# EAGLE schematic HM_Nightfall-mini-2e_v1 (EAGLE 9.6.2)
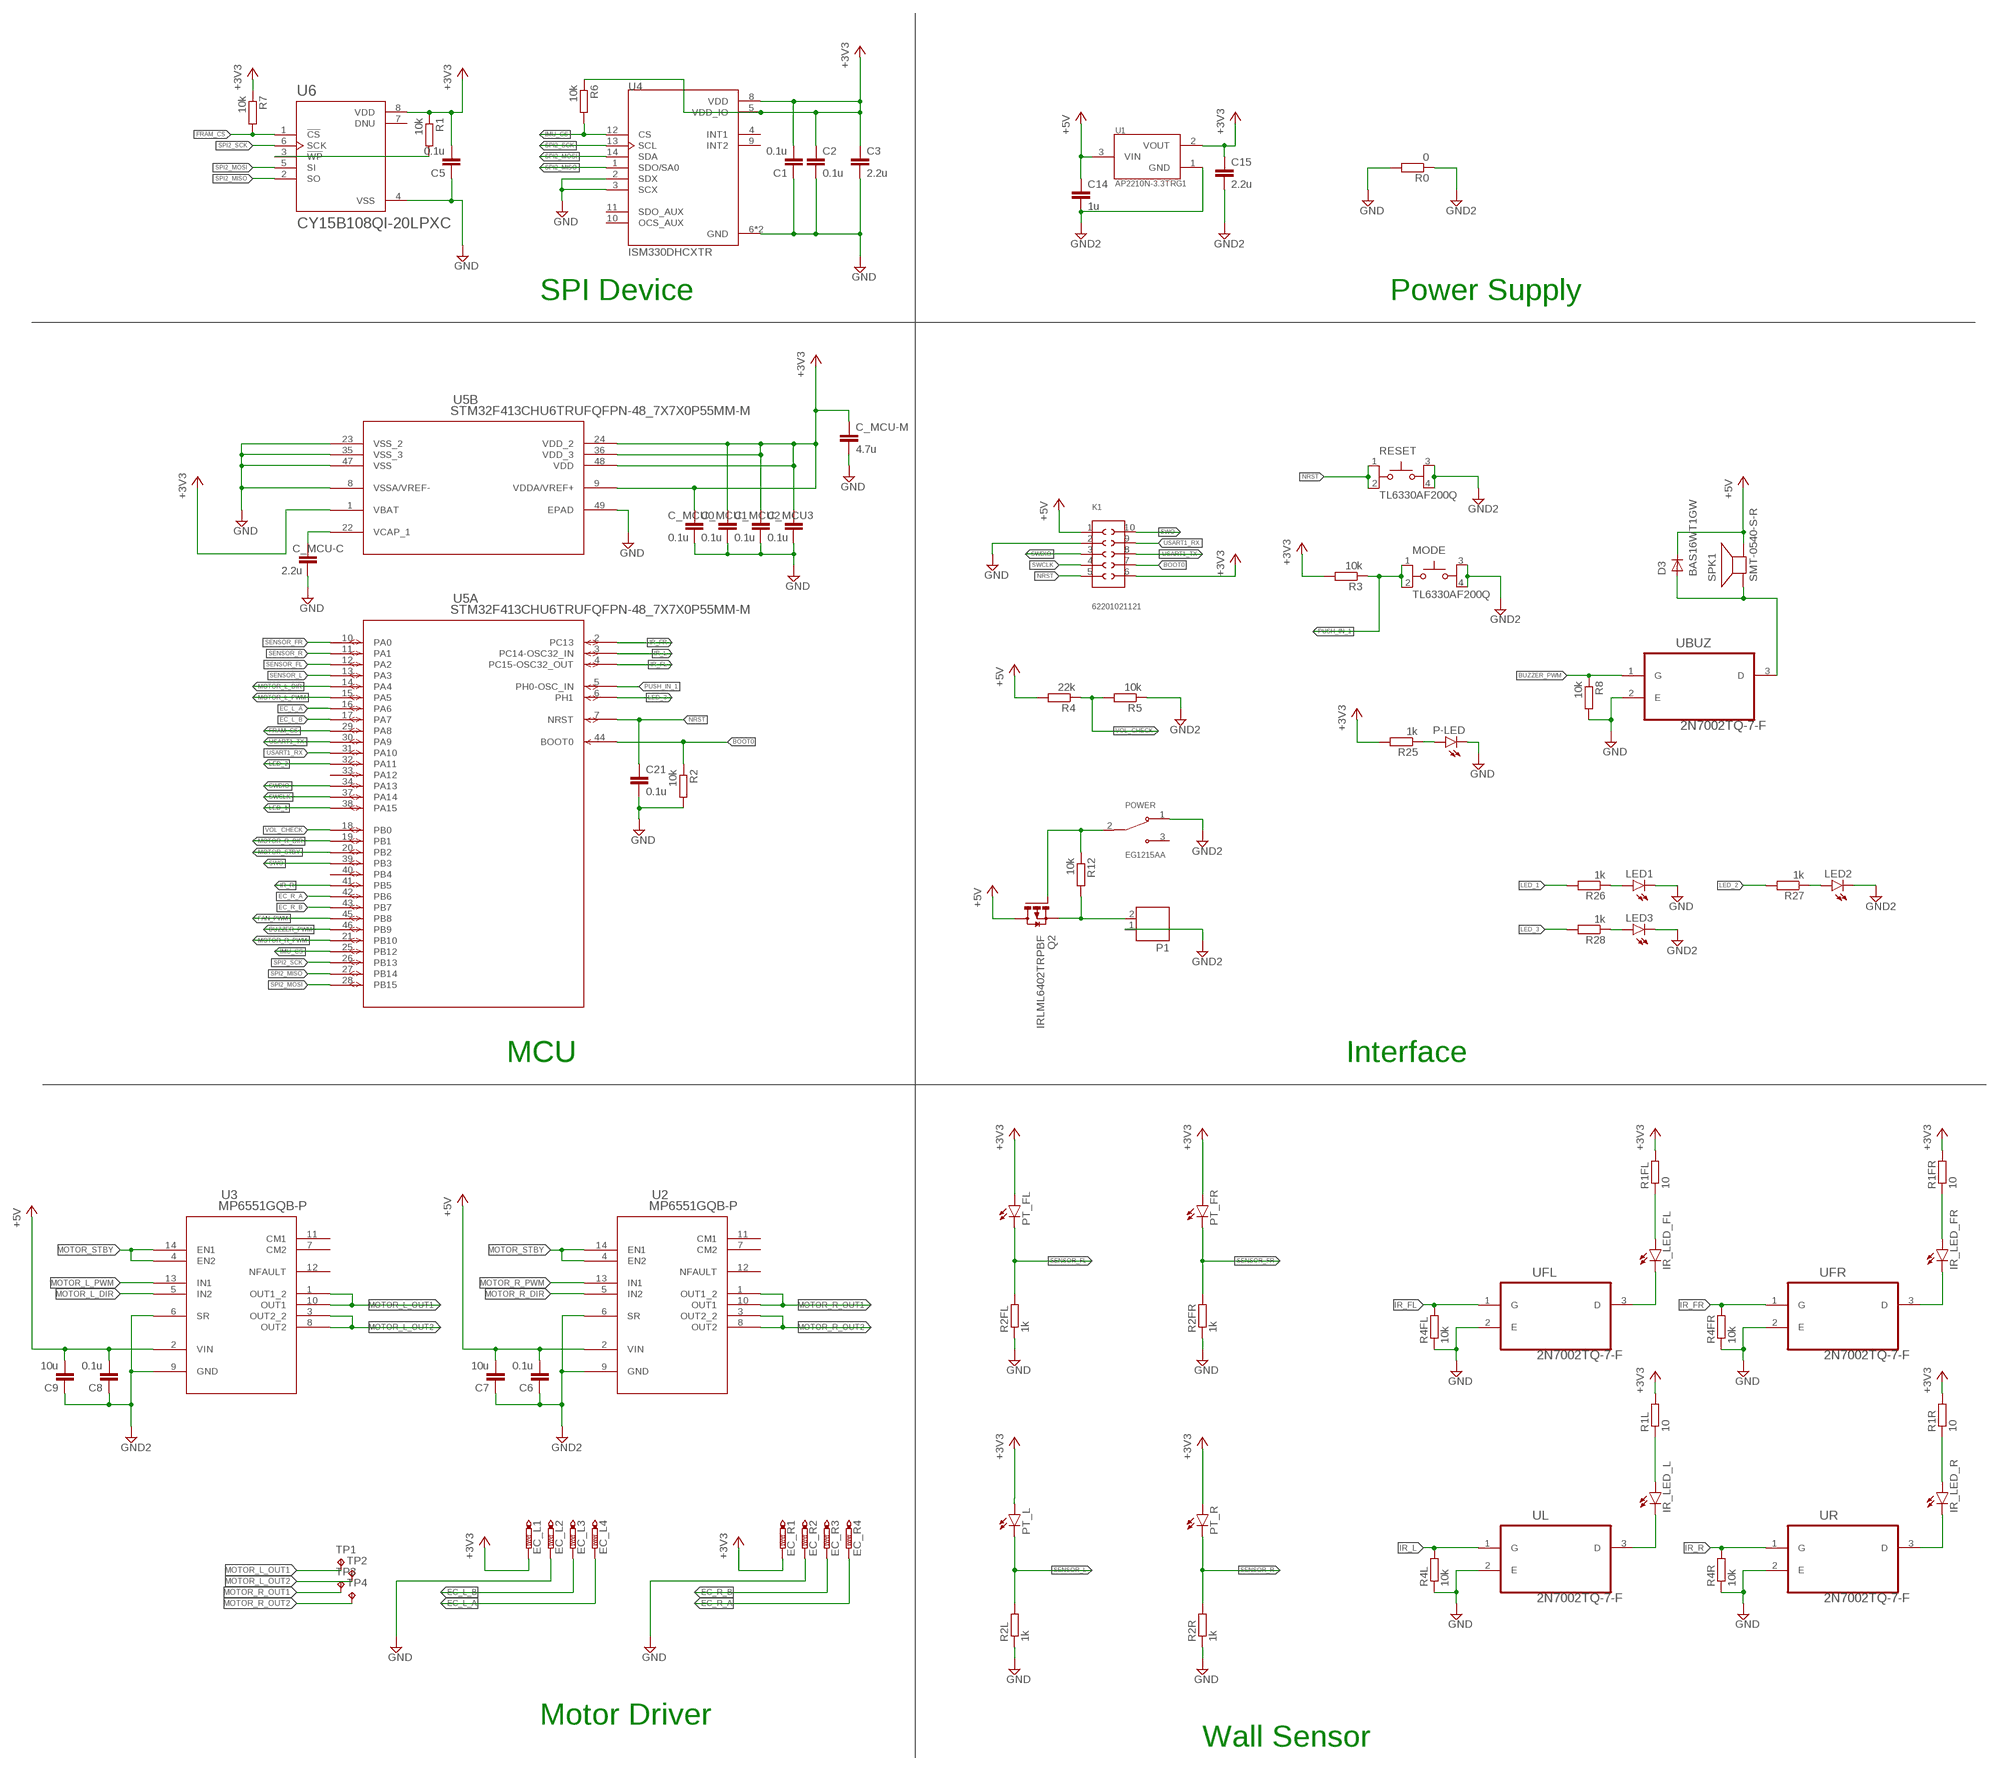
[diagram p0: schematic, sheet 1]

## Parts
C1  0.1u  C-EUC0402  [C0402]
C2  0.1u  C-EUC0402  [C0402]
C3  2.2u  C-EUC0402  [C0402]
C5  0.1u  C-EUC0402  [C0402]
C6  0.1u  C-EUC0402  [C0402]
C7  10u  C-EUC0402  [C0402]
C8  0.1u  C-EUC0402  [C0402]
C9  10u  C-EUC0402  [C0402]
C14  1u  C-EUC0402  [C0402]
C15  2.2u  C-EUC0402  [C0402]
C21  0.1u  C-EUC0402  [C0402]
C_MCU0  0.1u  C-EUC0402  [C0402]
C_MCU1  0.1u  C-EUC0402  [C0402]
C_MCU2  0.1u  C-EUC0402  [C0402]
C_MCU3  0.1u  C-EUC0402  [C0402]
C_MCU-C  2.2u  C-EUC0402  [C0402]
C_MCU-M  4.7u  C-EUC0402  [C0402]
D3  BAS16WT1GW  [SOT323]
EC_L1  PTR1TP06SQ  [TP06SQ]
EC_L2  PTR1TP06SQ  [TP06SQ]
EC_L3  PTR1TP06SQ  [TP06SQ]
EC_L4  PTR1TP06SQ  [TP06SQ]
EC_R1  PTR1TP06SQ  [TP06SQ]
EC_R2  PTR1TP06SQ  [TP06SQ]
EC_R3  PTR1TP06SQ  [TP06SQ]
EC_R4  PTR1TP06SQ  [TP06SQ]
IR_LED_FL  LED3MM  [LED3MM]
IR_LED_FR  LED3MM  [LED3MM]
IR_LED_L  LED3MM  [LED3MM]
IR_LED_R  LED3MM  [LED3MM]
K1  62201021121  [62201021121]
LED1  LEDCHIPLED_0603  [CHIPLED_0603]
LED2  LEDCHIPLED_0603  [CHIPLED_0603]
LED3  LEDCHIPLED_0603  [CHIPLED_0603]
MODE  TL6330AF200Q  [SW_TL6330AF200Q]
P1  JST-PH2  [JST-PH2]
P-LED  LEDCHIPLED_0603  [CHIPLED_0603]
POWER  EG1215AA  [SW_EG1215AA]
PT_FL  LED3MM  [LED3MM]
PT_FR  LED3MM  [LED3MM]
PT_L  LED3MM  [LED3MM]
PT_R  LED3MM  [LED3MM]
Q2  IRLML6402TRPBF  [SOT23]
R0  0  R-EU_R0402  [R0402]
R1  10k  R-EU_R0402  [R0402]
R1FL  10  R-EU_R0402  [R0402]
R1FR  10  R-EU_R0402  [R0402]
R1L  10  R-EU_R0402  [R0402]
R1R  10  R-EU_R0402  [R0402]
R2  10k  R-EU_R0402  [R0402]
R2FL  1k  R-EU_R0402  [R0402]
R2FR  1k  R-EU_R0402  [R0402]
R2L  1k  R-EU_R0402  [R0402]
R2R  1k  R-EU_R0402  [R0402]
R3  10k  R-EU_R0402  [R0402]
R4  22k  R-EU_R0402  [R0402]
R4FL  10k  R-EU_R0402  [R0402]
R4FR  10k  R-EU_R0402  [R0402]
R4L  10k  R-EU_R0402  [R0402]
R4R  10k  R-EU_R0402  [R0402]
R5  10k  R-EU_R0402  [R0402]
R6  10k  R-EU_R0402  [R0402]
R7  10k  R-EU_R0402  [R0402]
R8  10k  R-EU_R0402  [R0402]
R12  10k  R-EU_R0402  [R0402]
R25  1k  R-EU_R0402  [R0402]
R26  1k  R-EU_R0402  [R0402]
R27  1k  R-EU_R0402  [R0402]
R28  1k  R-EU_R0402  [R0402]
RESET  TL6330AF200Q  [SW_TL6330AF200Q]
SPK1  SMT-0540-S-R  [SMT-0540-S-R]
TP1  TPB1,27  [B1,27]
TP2  TPB1,27  [B1,27]
TP3  TPB1,27  [B1,27]
TP4  TPB1,27  [B1,27]
U1  AP2210N-3.3TRG1  [SOT95P280X145-3N]
U2  MP6551GQB-P  [QFN-14_MP6551_MNP]
U3  MP6551GQB-P  [QFN-14_MP6551_MNP]
U4  ISM330DHCXTR  [PQFN50P250X300X86-14N]
U5  STM32F413CHU6TRUFQFPN-48_7X7X0P55MM-M  [UFQFPN-48_7X7X0P55MM-M]
U6  CY15B108QI-20LPXC  [SON65P328X323X55-8N]
UBUZ  2N7002TQ-7-F  [SOT50P160X90-3N]
UFL  2N7002TQ-7-F  [SOT50P160X90-3N]
UFR  2N7002TQ-7-F  [SOT50P160X90-3N]
UL  2N7002TQ-7-F  [SOT50P160X90-3N]
UR  2N7002TQ-7-F  [SOT50P160X90-3N]

## Nets
+3V3 [power]: C1.2 C2.1 C3.1 C5.2 C15.1 C_MCU0.1 C_MCU1.1 C_MCU2.1 C_MCU3.1 C_MCU-M.1 EC_L1.TP EC_R1.TP K1.6 PT_FL.A PT_FR.A PT_L.A PT_R.A R1.1 R1FL.2 R1FR.2 R1L.2 R1R.2 R3.2 R6.1 R7.1 R25.2 U1.2(VOUT) U4.5(VDD_IO) U4.8(VDD) U5.1(B:VBAT) U5.9(B:VDDA/VREF+) U5.24(B:VDD_2) U5.36(B:VDD_3) U5.48(B:VDD) U6.8(VDD)
+5V [power]: C6.2 C7.2 C8.2 C9.2 C14.1 D3.3(K) K1.1 Q2.3(D) R4.2 SPK1.+(-) U1.3(VIN) U2.2(VIN) U3.2(VIN)
BOOT0: K1.7 R2.1 U5.44(A:BOOT0)
BUZZER_PWM: R8.1 U5.46(A:PB9) UBUZ.1(G)
EC_L_A: EC_L4.TP U5.16(A:PA6)
EC_L_B: EC_L3.TP U5.17(A:PA7)
EC_R_A: EC_R4.TP U5.42(A:PB6)
EC_R_B: EC_R3.TP U5.43(A:PB7)
FAN_PWM: U5.45(A:PB8)
FRAM_CS: R7.2 U5.29(A:PA8) U6.1(!CS)
GND [motor]: C1.1 C2.2 C3.2 C5.1 C21.2 C_MCU0.2 C_MCU1.2 C_MCU2.2 C_MCU3.2 C_MCU-C.2 C_MCU-M.2 EC_L2.TP EC_R2.TP K1.2 LED1.C P-LED.C R0.2 R2.2 R2FL.1 R2FR.1 R2L.1 R2R.1 R4FL.1 R4FR.1 R4L.1 R4R.1 R8.2 U4.2(SDX) U4.3(SCX) U4.6(GND) U4.7(GND) U5.8(B:VSSA/VREF-) U5.23(B:VSS_2) U5.35(B:VSS_3) U5.47(B:VSS) U5.49(B:EPAD) U6.4(VSS) UBUZ.2(E) UFL.2(E) UFR.2(E) UL.2(E) UR.2(E)
GND2 [motor]: C6.1 C7.1 C8.1 C9.1 C14.2 C15.2 LED2.C LED3.C MODE.3 MODE.4 P1.1 POWER.1 R0.1 R5.1 RESET.3 RESET.4 U1.1(GND) U2.6(SR) U2.9(GND) U3.6(SR) U3.9(GND)
IMU_CS: R6.2 U4.12(CS) U5.25(A:PB12)
IR_FL: R4FL.2 U5.4(A:PC15-OSC32_OUT) UFL.1(G)
IR_FR: R4FR.2 U5.2(A:PC13) UFR.1(G)
IR_L: R4L.2 U5.3(A:PC14-OSC32_IN) UL.1(G)
IR_R: R4R.2 U5.41(A:PB5) UR.1(G)
LED_1: R26.2 U5.38(A:PA15)
LED_2: R27.2 U5.32(A:PA11)
LED_3: R28.2 U5.6(A:PH1)
MOTOR_L_DIR: U3.5(IN2) U5.14(A:PA4)
MOTOR_L_OUT1 [motor]: TP1.TP U3.1(OUT1_2) U3.10(OUT1)
MOTOR_L_OUT2 [motor]: TP2.TP U3.3(OUT2_2) U3.8(OUT2)
MOTOR_L_PWM: U3.13(IN1) U5.15(A:PA5)
MOTOR_R_DIR: U2.5(IN2) U5.19(A:PB1)
MOTOR_R_OUT1 [motor]: TP3.TP U2.1(OUT1_2) U2.10(OUT1)
MOTOR_R_OUT2 [motor]: TP4.TP U2.3(OUT2_2) U2.8(OUT2)
MOTOR_R_PWM: U2.13(IN1) U5.21(A:PB10)
MOTOR_STBY: U2.4(EN2) U2.14(EN1) U3.4(EN2) U3.14(EN1) U5.20(A:PB2)
N$2: IR_LED_FL.K(C) UFL.3(D)
N$4: R1.2 U6.3(!WP)
N$5: C_MCU-C.1 U5.22(B:VCAP_1)
N$7: P1.2 Q2.2(S) R12.2
N$8: IR_LED_FL.A R1FL.1
N$10: IR_LED_L.K(C) UL.3(D)
N$11: POWER.2 Q2.1(G) R12.1
N$16: IR_LED_L.A R1L.1
N$18: IR_LED_FR.K(C) UFR.3(D)
N$21: P-LED.A R25.1
N$23: D3.1(A) SPK1.-(+) UBUZ.3(D)
N$27: LED1.A R26.1
N$28: IR_LED_FR.A R1FR.1
N$29: IR_LED_R.K(C) UR.3(D)
N$30: IR_LED_R.A R1R.1
N$36: LED2.A R27.1
N$41: LED3.A R28.1
NRST: C21.1 K1.5 RESET.1 RESET.2 U5.7(A:NRST)
PUSH_IN_1: MODE.1 MODE.2 R3.1 U5.5(A:PH0-OSC_IN)
SENSOR_FL: PT_FL.K(C) R2FL.2 U5.12(A:PA2)
SENSOR_FR: PT_FR.K(C) R2FR.2 U5.10(A:PA0)
SENSOR_L: PT_L.K(C) R2L.2 U5.13(A:PA3)
SENSOR_R: PT_R.K(C) R2R.2 U5.11(A:PA1)
SPI2_MISO: U4.1(SDO/SA0) U5.27(A:PB14) U6.2(SO)
SPI2_MOSI: U4.14(SDA) U5.28(A:PB15) U6.5(SI)
SPI2_SCK: U4.13(SCL) U5.26(A:PB13) U6.6(SCK)
SWCLK: K1.4 U5.37(A:PA14)
SWDIO: K1.3 U5.34(A:PA13)
SWO: K1.10 U5.39(A:PB3)
USART1_RX: K1.9 U5.31(A:PA10)
USART1_TX: K1.8 U5.30(A:PA9)
VOL_CHECK: R4.1 R5.2 U5.18(A:PB0)
Unconnected: POWER.3 U2.7(CM2) U2.11(CM1) U2.12(NFAULT) U3.7(CM2) U3.11(CM1) U3.12(NFAULT) U4.4(INT1) U4.9(INT2) U4.10(OCS_AUX) U4.11(SDO_AUX) U5.33(A:PA12) U5.40(A:PB4) U6.7(DNU)

## Notes on the sheet
- SPI Device | Power Supply
- MCU | Interface
- Motor Driver
- Wall Sensor

## Library data of the parts
C1-C3 C5-C9 C14 C15 C21 C_MCU0 C_MCU1-C_MCU3 C_MCU-C C_MCU-M = rcl:C-EU: CAPACITOR, European symbol; SPICEPREFIX: C
D3 = BAS16WT1G:BAS16WT1G: Check availability <https://pricing.snapeda.com/parts/BAS16WT1G/ON%20Semiconductor/view-part?ref=eda>; AVAILABILITY: In Stock; CHECK_PRICES: https://www.snapeda.com/parts/BAS16WT1G/Onsemi/view-part/?ref=eda; DESCRIPTION: DIODE, SIGNAL, 75V, SC70; Diode Type:Small Signal; Voltage, Vrrm:75V; Time, trr Typ:6ns; Voltage, Vf Max:1.25V; Temperature, Tj Max:150°C; Termination Type:SMD; Operating Temperature Range:-55°C to +150°C; Case Style:SC-70; No. of Pins:3; Voltage, Breakdown Max:75V; MF: ON Semiconductor; MP: BAS16WT1G; PACKAGE: SC-70-3 ON Semiconductor; PRICE: None; SNAPEDA_LINK: https://www.snapeda.com/parts/BAS16WT1G/Onsemi/view-part/?ref=snap
EC_L1-EC_L4 EC_R1-EC_R4 = testpad:PTR1: TEST PIN
IR_LED_FL IR_LED_FR IR_LED_L IR_LED_R LED1-LED3 P-LED PT_FL PT_FR PT_L PT_R = led:LED: LED OSRAM: - CHIPLED LG R971, LG N971, LY N971, LG Q971, LY Q971, LO R971, LY R971 LH N974, LH R974 LS Q976, LO Q976, LY Q976 LO Q996 - Hyper CHIPLED LW Q18S LB Q993, LB Q99A, LB R99A - SideLED LS A670, LO A670, LY A670, LG A670, LP A670 LB A673, LV A673, LT A673, LW A673 LH A674 LY A675 LS A676, LA A676, LO A676, LY A676, LW A676 LS A679, LY A679, LG A679 - Hyper Micro SIDELED® LS Y876, LA Y876, LO Y876, LY Y876 LT Y87S - SmartLED LW L88C, LW L88S LB L89C, LB L89S, LG L890 LS L89K, LO L89K, LY L89K LS L896, LA L896, LO L896, LY L896 - TOPLED LS T670, LO T670, LY T670, LG T670, LP T670 LSG T670, LSP T670, LSY T670, LOP T670, LYG T670 LG T671, LOG T671, LSG T671 LB T673, LV T673, LT T673, LW T673 LH T674 LS T676, LA T676, LO T676, LY T676, LB T676, LH T676, LSB T676, LW T676 LB T67C, LV T67C, LT T67C, LS T67K, LO T67K, LY T67K, LW E67C LS E67B, LA E67B, LO E67B, LY E67B, LB E67C, LV E67C, LT E67C LW T67C LS T679, LY T679, LG T679 LS T770, LO T770, LY T770, LG T770, LP T770 LB T773, LV T773, LT T773, LW T773 LH T774 LS E675, LA E675, LY E675, LS T675 LS T776, LA T776, LO T776, LY T776, LB T776 LHGB T686 LT T68C, LB T68C - Hyper Mini TOPLED® LB M676 - Mini TOPLED Santana® LG M470 LS M47K, LO M47K, LY M47K Source: http://www.osram.convergy.de LUXEON: - LUMILED® LXK2-PW12-R00, LXK2-PW12-S00, LXK2-PW14-U00, LXK2-PW14-V00 LXK2-PM12-R00, LXK2-PM12-S00, LXK2-PM14-U00 LXK2-PE12-Q00, LXK2-PE12-R00, LXK2-PE12-S00, LXK2-PE14-T00, LXK2-PE14-U00 LXK2-PB12-K00, LXK2-PB12-L00, LXK2-PB12-M00, LXK2-PB14-N00, LXK2-PB14-P00, LXK2-PB14-Q00 LXK2-PR12-L00, LXK2-PR12-M00, LXK2-PR14-Q00, LXK2-PR14-R00 LXK2-PD12-Q00, LXK2-PD12-R00, LXK2-PD12-S00 LXK2-PH12-R00, LXK2-PH12-S00 LXK2-PL12-P00, LXK2-PL12-Q00, LXK2-PL12-R00 Source: www.luxeon.com KINGBRIGHT: KA-3528ASYC Source: www.kingbright.com
K1 = pinheader_1m27:62201021121: WR-PHD 1.27mm Dual Pin Header, 10 Pins=>Code : Con_BTB_PHD_1.27_2_62201021121 <http://katalog.we-online.de/media/thumbs2/eican/thb_Con_BTB_PHD_1.27_2_6220xx21121_pf2.jpg> Details see: http://katalog.we-online.de/en/em/622_0xx_211_21 Created 2014-06-03, Karrer Zheng 2014 (C) Würth Elektronik
MODE RESET = TL6330AF200Q:TL6330AF200Q: Check availability <https://pricing.snapeda.com/parts/TL6330AF200Q/E-Switch/view-part?ref=eda>; AVAILABILITY: In Stock; CHECK_PRICES: https://www.snapeda.com/parts/TL6330AF200Q/E-Switch/view-part/?ref=eda; DESCRIPTION: Tactile Switch SPST-NO Top Actuated Surface Mount; MF: E-Switch; MP: TL6330AF200Q; PACKAGE: None; PRICE: None; PURCHASE-URL: https://www.snapeda.com/api/url_track_click_mouser/?unipart_id=2720563&manufacturer=E-Switch&part_name=TL6330AF200Q&search_term=tl6330af200q; SNAPEDA_LINK: https://www.snapeda.com/parts/TL6330AF200Q/E-Switch/view-part/?ref=snap
P1 = jst-ph:JST-PH2
POWER = EG1215AA:EG1215AA: Slide Switch SPDT Surface Mount, Right Angle Check availability <https://pricing.snapeda.com/parts/EG1215AA/E-Switch/view-part?ref=eda>; AVAILABILITY: In Stock; CHECK_PRICES: https://www.snapeda.com/parts/EG1215AA/E-Switch/view-part/?ref=eda; DESCRIPTION: Slide Switch SPDT Surface Mount, Right Angle; MF: E-Switch; MP: EG1215AA; PACKAGE: None; PRICE: None; PURCHASE-URL: https://www.snapeda.com/api/url_track_click_mouser/?unipart_id=3210616&manufacturer=E-Switch&part_name=EG1215AA&search_term=eg1215aa; SNAPEDA_LINK: https://www.snapeda.com/parts/EG1215AA/E-Switch/view-part/?ref=snap
Q2 = IRLML6402:IRLML6402: Check availability <https://pricing.snapeda.com/parts/IRLML6402/Infineon%20Technologies/view-part?ref=eda>; AVAILABILITY: In Stock; CHECK_PRICES: https://www.snapeda.com/parts/IRLML6402/Infineon/view-part/?ref=eda; DESCRIPTION: P-Channel 20 V 3.7A (Ta) 1.3W (Ta) Surface Mount Micro3â„¢ /SOT-23; MF: Infineon Technologies; MP: IRLML6402; PACKAGE: SOT-23-3 ON Semiconductor; PRICE: None; SNAPEDA_LINK: https://www.snapeda.com/parts/IRLML6402/Infineon/view-part/?ref=snap
R0 R1 R1FL R1FR R1L R1R R2 R2FL R2FR R2L R2R R3 R4 R4FL R4FR R4L R4R R5-R8 R12 R25-R28 = rcl:R-EU_: RESISTOR, European symbol; SPICEPREFIX: R
SPK1 = SMT-0540-S-R:SMT-0540-S-R: SMT-0549-S-R Small surface-mount magnetic buzzer; DESCRIPTION: Buzzers Transducer, Externally Driven Electromechanical/Magnetic 3V 100mA 4kHz 78dB @ 3V, 10cm Surface Mount Solder Pads; DIGI-KEY_PART_NUMBER: 668-1060-1-ND; MF: PUI; MP: SMT-0540-S-R; PACKAGE: PUI; PURCHASE-URL: https://pricing.snapeda.com/search/part/SMT-0540-S-R/?ref=eda
TP1-TP4 = testpad:TP: Test pad
U1 = AP2210N-3.3TRG1:AP2210N-3.3TRG1: LDO Regulator Pos 5V 0.3A 3-Pin SOT-23 T/R Check availability <https://pricing.snapeda.com/parts/AP2210N-3.3TRG1/Diodes%20Inc./view-part?ref=eda>; AVAILABILITY: In Stock; CHECK_PRICES: https://www.snapeda.com/parts/AP2210N-3.3TRG1/Diodes+Inc./view-part/?ref=eda; DESCRIPTION: Voltage Regulators, LDO, 300mA CMOS LDO 3.3V 250mV | Diodes Inc AP2210N-3.3TRG1; MF: Diodes Inc.; MP: AP2210N-3.3TRG1; PACKAGE: SOT-23-3 Diodes Inc.; PRICE: None; PURCHASE-URL: https://www.snapeda.com/api/url_track_click_mouser/?unipart_id=492437&manufacturer=Diodes Inc.&part_name=AP2210N-3.3TRG1&search_term=ldo 3.3v; SNAPEDA_LINK: https://www.snapeda.com/parts/AP2210N-3.3TRG1/Diodes+Inc./view-part/?ref=snap
U2 U3 = MP6551:MP6551GQB-P; COPYRIGHT: Copyright (C) 2025 Ultra Librarian. All rights reserved.; MANUFACTURER_PART_NUMBER: MP6551GQB-P; MFR_NAME: Monolithic Power Systems
U4 = ISM330DHCXTR:ISM330DHCXTR: Check availability <https://pricing.snapeda.com/parts/ISM330DHCXTR/STMicroelectronics/view-part?ref=eda>; AVAILABILITY: In Stock; CHECK_PRICES: https://www.snapeda.com/parts/ISM330DHCXTR/STMicroelectronics/view-part/?ref=eda; DESCRIPTION: Accelerometer, Gyroscope, Temperature, 6 Axis Sensor I2C, SPI Output; MF: STMicroelectronics; MP: ISM330DHCXTR; PACKAGE: VFLGA-14 STMicroelectronics; PRICE: None; SNAPEDA_LINK: https://www.snapeda.com/parts/ISM330DHCXTR/STMicroelectronics/view-part/?ref=snap
U5 = STM32F413CHU6TR:STM32F413CHU6TR; COPYRIGHT: Copyright (C) 2026 Ultra Librarian. All rights reserved.; DATASHEET: https://www.st.com/resource/en/datasheet/stm32f413cg.pdf; DESCRIPTION: High-performance access line, Arm Cortex-M4 core with DSP and FPU, 1,5 MByte of Flash memory, 100 MHz CPU, ART Accelerator, DFSDM; MANUFACTURER_NAME: STMicroelectronics; MANUFACTURER_PART_NUMBER: STM32F413CHU6TR
U6 = CY15B108QI-20LPXC:CY15B108QI-20LPXC: Check availability <https://pricing.snapeda.com/parts/CY15B108QI-20LPXC/Cypress%20Semiconductor/view-part?ref=eda>; AVAILABILITY: In Stock; CHECK_PRICES: https://www.snapeda.com/parts/CY15B108QI-20LPXC/Infineon/view-part/?ref=eda; DESCRIPTION: FRAM (Ferroelectric RAM) Memory IC 8Mb (1M x 8) SPI 20 MHz 8-GQFN (3.23x3.28); MF: Cypress Semiconductor; MP: CY15B108QI-20LPXC; PACKAGE: UQFN-8 Cypress Semiconductor Corp; PRICE: None; PURCHASE-URL: https://www.snapeda.com/api/url_track_click_mouser/?unipart_id=4328169&manufacturer=Cypress Semiconductor&part_name=CY15B108QI-20LPXC&search_term=None; SNAPEDA_LINK: https://www.snapeda.com/parts/CY15B108QI-20LPXC/Infineon/view-part/?ref=snap
UBUZ UFL UFR UL UR = 2N7002TQ-7-F:2N7002TQ-7-F: Check availability <https://pricing.snapeda.com/parts/2N7002TQ-7-F/Diodes%20Inc./view-part?ref=eda>; AVAILABILITY: In Stock; CHECK_PRICES: https://www.snapeda.com/parts/2N7002TQ-7-F/Diodes+Inc./view-part/?ref=eda; DESCRIPTION: N-Channel 60 V 115mA (Ta) 150mW (Ta) Surface Mount SOT-523; MF: Diodes Inc.; MP: 2N7002TQ-7-F; PACKAGE: SOT-523 Diodes Inc.; PRICE: None; SNAPEDA_LINK: https://www.snapeda.com/parts/2N7002TQ-7-F/Diodes+Inc./view-part/?ref=snap

## Net classes
1 power: width 0.152 mm
2 motor: width 0.152 mm